# EAGLE design chipchestra-v05-buttons (EAGLE 8.0.1)
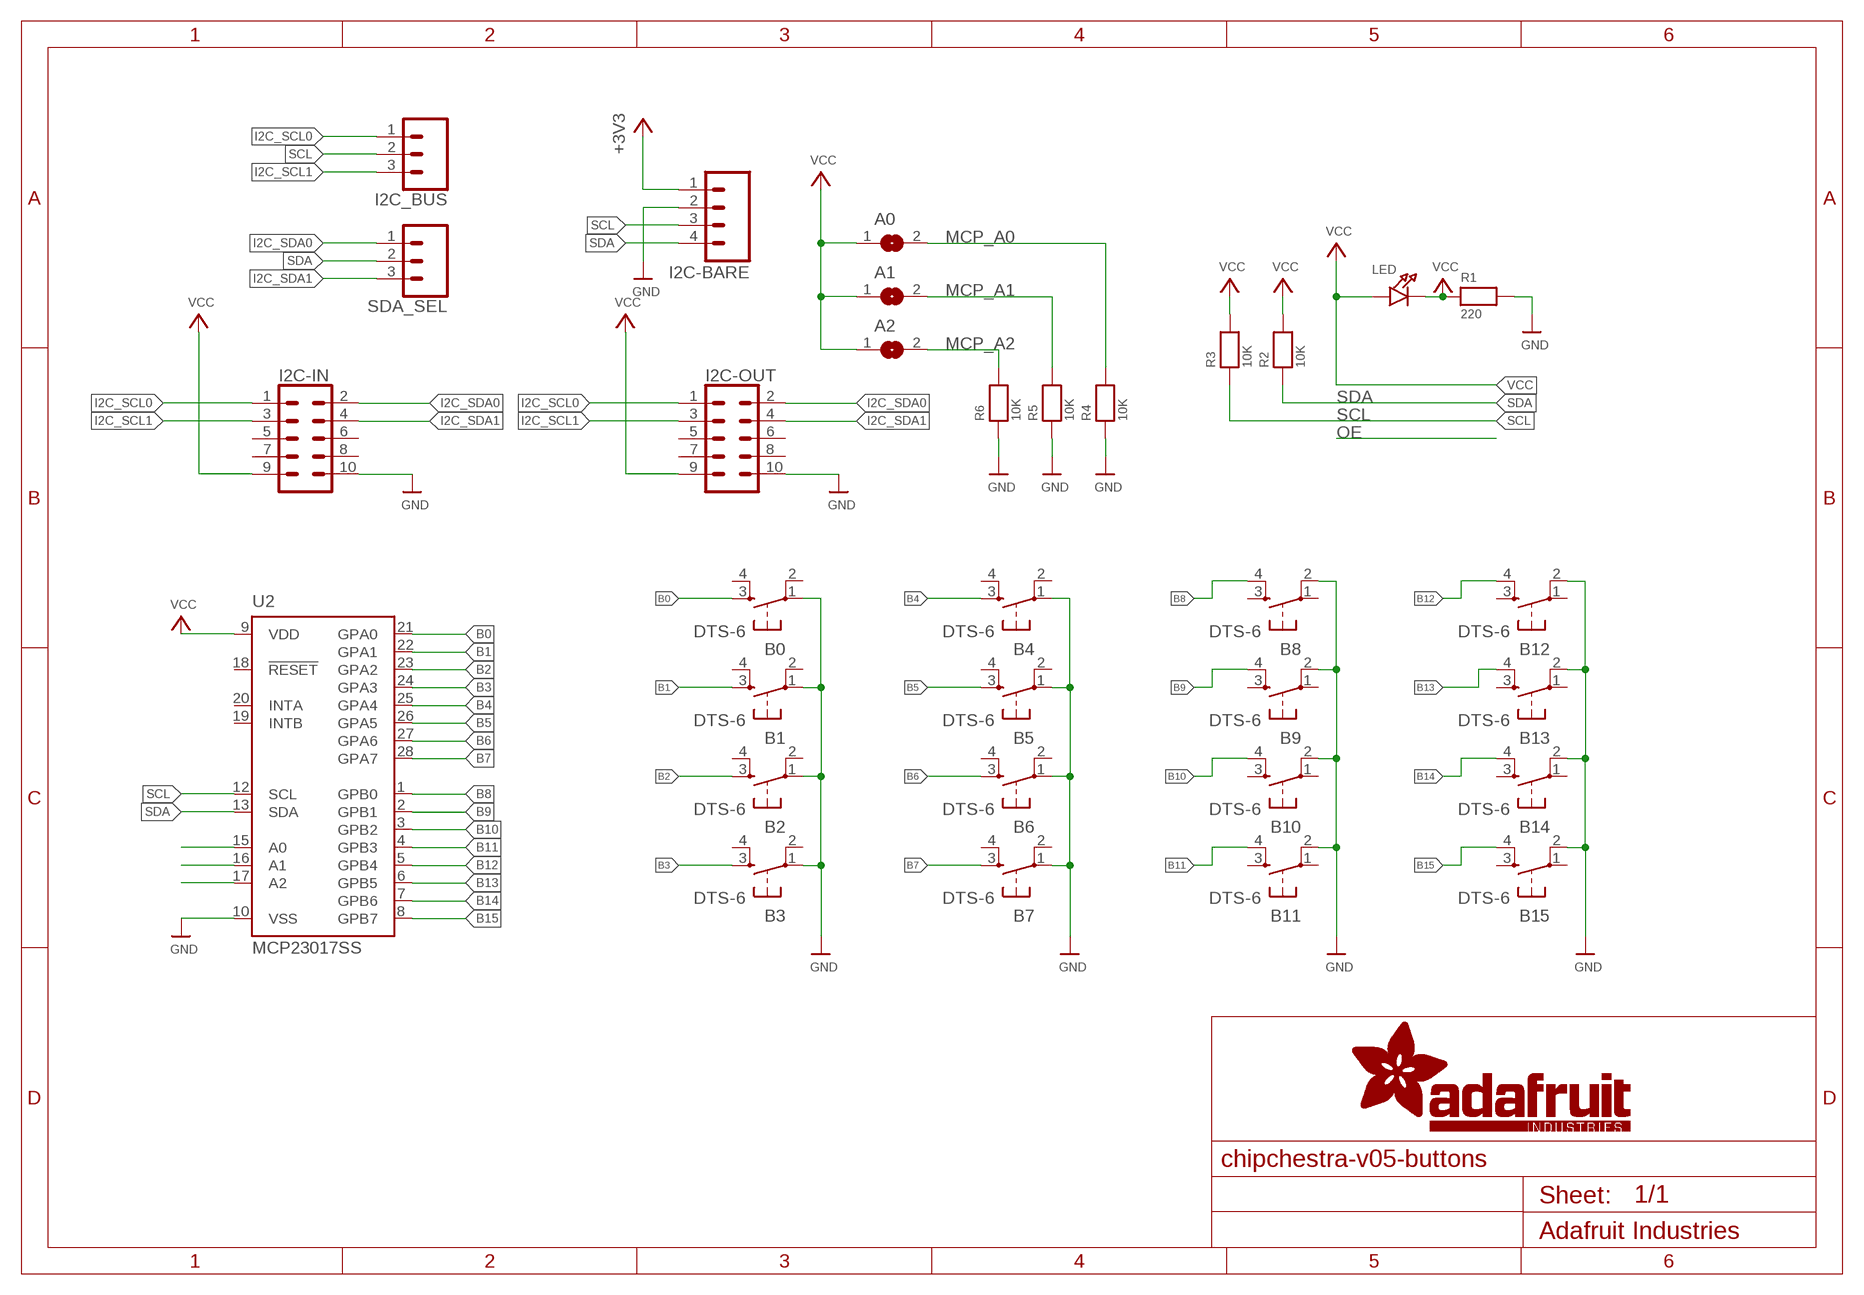
[diagram p0: schematic, sheet 1]

## Parts
A0  SOLDERJUMPERREFLOW_NOPASTE  [SOLDERJUMPER_REFLOW_NOPASTE]
A1  SOLDERJUMPERREFLOW_NOPASTE  [SOLDERJUMPER_REFLOW_NOPASTE]
A2  SOLDERJUMPERREFLOW_NOPASTE  [SOLDERJUMPER_REFLOW_NOPASTE]
B0  DTS-6  [DTS-6]
B1  DTS-6  [DTS-6]
B2  DTS-6  [DTS-6]
B3  DTS-6  [DTS-6]
B4  DTS-6  [DTS-6]
B5  DTS-6  [DTS-6]
B6  DTS-6  [DTS-6]
B7  DTS-6  [DTS-6]
B8  DTS-6  [DTS-6]
B9  DTS-6  [DTS-6]
B10  DTS-6  [DTS-6]
B11  DTS-6  [DTS-6]
B12  DTS-6  [DTS-6]
B13  DTS-6  [DTS-6]
B14  DTS-6  [DTS-6]
B15  DTS-6  [DTS-6]
I2C-BARE  M04LOCK  [1X04_LOCK]
I2C-IN  CONN_05X2SHD_LOCK  [2X5-SHROUDED_LOCK]
I2C-OUT  CONN_05X2SHD_LOCK  [2X5-SHROUDED_LOCK]
I2C_BUS  CONN_03LOCK  [1X03_LOCK]
LED  LED0805  [CHIPLED_0805]
R1  220  RESISTOR0805  [0805]
R2  10K  RESISTOR0805  [0805]
R3  10K  RESISTOR0805  [0805]
R4  10K  RESISTOR0805  [0805]
R5  10K  RESISTOR0805  [0805]
R6  10K  RESISTOR0805  [0805]
SDA_SEL  CONN_03LOCK  [1X03_LOCK]
U2  MCP23017SS  [SSOP28]

## Nets
+3V3: I2C-BARE.1
B0: B0.3 U2.21(GPA0)
B1: B1.3 U2.22(GPA1)
B2: B2.3 U2.23(GPA2)
B3: B3.3 U2.24(GPA3)
B4: B4.3 U2.25(GPA4)
B5: B5.3 U2.26(GPA5)
B6: B6.3 U2.27(GPA6)
B7: B7.3 U2.28(GPA7)
B8: B8.4 U2.1(GPB0)
B9: B9.4 U2.2(GPB1)
B10: B10.4 U2.3(GPB2)
B11: B11.4 U2.4(GPB3)
B12: B12.4 U2.5(GPB4)
B13: B13.4 U2.6(GPB5)
B14: B14.4 U2.7(GPB6)
B15: B15.4 U2.8(GPB7)
GND: B0.1 B1.1 B2.1 B3.1 B4.1 B5.1 B6.1 B7.1 B8.2 B9.2 B10.2 B11.2 B12.2 B13.2 B14.2 B15.2 I2C-BARE.2 I2C-IN.10 I2C-OUT.10 R1.2 R4.1 R5.1 R6.1 U2.10(VSS)
I2C_SCL0: I2C-IN.1 I2C-OUT.1 I2C_BUS.1
I2C_SCL1: I2C-IN.3 I2C-OUT.3 I2C_BUS.3
I2C_SDA0: I2C-IN.2 I2C-OUT.2 SDA_SEL.1
I2C_SDA1: I2C-IN.4 I2C-OUT.4 SDA_SEL.3
MCP_A0: A0.2 R4.2 U2.15(A0)
MCP_A1: A1.2 R5.2 U2.16(A1)
MCP_A2: A2.2 R6.2 U2.17(A2)
N$1: LED.C R1.1 ; supply symbol labelled VCC
SCL: I2C-BARE.3 I2C_BUS.2 R3.1 U2.12(SCL)
SDA: I2C-BARE.4 R2.1 SDA_SEL.2 U2.13(SDA)
VCC: A0.1 A1.1 A2.1 I2C-IN.9 I2C-OUT.9 LED.A R2.2 R3.2 U2.9(VDD)
Unconnected: B0.2 B0.4 B1.2 B1.4 B2.2 B2.4 B3.2 B3.4 B4.2 B4.4 B5.2 B5.4 B6.2 B6.4 B7.2 B7.4 B8.1 B8.3 B9.1 B9.3 B10.1 B10.3 B11.1 B11.3 B12.1 B12.3 B13.1 B13.3 B14.1 B14.3 B15.1 B15.3 I2C-IN.5 I2C-IN.6 I2C-IN.7 I2C-IN.8 I2C-OUT.5 I2C-OUT.6 I2C-OUT.7 I2C-OUT.8 U2.18(!RESET) U2.19(INTB) U2.20(INTA)

## Library data of the parts
A0 A1 A2 = microbuilder:SOLDERJUMPER: SMD Solder JUMPER Solder the two pads together to create a connection, or remove the solder to break it. REFLOW - Use this footprint for solder paste and reflow ovens. WAVE - Use this footprint for hand-soldering (larger pads). CLOSED - Has a trace between the two pads to ensure it is closed by default. The trace needs to be cut to disable the jumper, and can be closed again by creating a solder bridge between the two pads.
B0 B1-B15 = switch-tact:DTS-6
I2C-BARE = CMU-ArtFab:M04: Header 4 Standard 4-pin 0.1" header. Use with straight break away headers (SKU : PRT-00116), right angle break away headers (PRT-00553), swiss pins (PRT-00743), machine pins (PRT-00117), and female headers (PRT-00115). Molex polarized connector foot print use with SKU : PRT-08231 with associated crimp pins and housings. 1MM SMD Version SKU: PRT-10208
I2C-IN I2C-OUT = SparkFun-Connectors:CONN_05X2: Multi connection point. Often used as Generic Header-pin footprint for 0.1 inch spaced/style header connections For AVR SPI programming port, see special device with nice symbol: "AVR_SPI_PROG_5x2.dev" You can populate with any combo of single row headers, but if you'd like an exact match, check these: 2x5 AVR ICSP Male Header <https://www.sparkfun.com/products/778> (PRT-00778) 2x5 Pin Shrouded Header <https://www.sparkfun.com/products/8506> (PRT-08506) On any of the 0.1 inch spaced packages, you can populate with these: Break Away Headers - Straight <https://www.sparkfun.com/products/116> (PRT-00116) Break Away Male Headers - Right Angle <https://www.sparkfun.com/products/553> (PRT-00553) Female Headers <https://www.sparkfun.com/products/115> (PRT-00115) Break Away Headers - Machine Pin <https://www.sparkfun.com/products/117> (PRT-00117) Break Away Female Headers - Swiss Machine Pin <https://www.sparkfun.com/products/743> (PRT-00743) Special note: the shrouded connector mates well with our 5x2 ribbon cables: 2x5 Pin IDC Ribbon Cable <https://www.sparkfun.com/products/8535> (PRT-08535); PROD_ID: CONN-08671; SF_ID: PRT-08506
I2C_BUS SDA_SEL = SparkFun-Connectors:CONN_03: Multi connection point. Often used as Generic Header-pin footprint for 0.1 inch spaced/style header connections On any of the 0.1 inch spaced packages, you can populate with these: Break Away Headers - Straight <https://www.sparkfun.com/products/116> (PRT-00116) Break Away Male Headers - Right Angle <https://www.sparkfun.com/products/553> (PRT-00553) Female Headers <https://www.sparkfun.com/products/115> (PRT-00115) Break Away Headers - Machine Pin <https://www.sparkfun.com/products/117> (PRT-00117) Break Away Female Headers - Swiss Machine Pin <https://www.sparkfun.com/products/743> (PRT-00743) Stackable Header - 3 Pin (Female, 0.1") <https://www.sparkfun.com/products/13875> (PRT-13875) For SCREWTERMINALS and SPRING TERMINALS visit here: Screw Terimnals on SparkFun.com <https://www.sparkfun.com/search/results?term=Screw+Terminals> (5mm/3.5mm/2.54mm spacing) This device is also useful as a general connection point to wire up your design to another part of your project. Our various solder wires solder well into these plated through hole pads. Hook-Up Wire - Assortment (Stranded, 22 AWG) <https://www.sparkfun.com/products/11375> (PRT-11375) Hook-Up Wire - Assortment (Solid Core, 22 AWG) <https://www.sparkfun.com/products/11367> (PRT-11367) View the entire wire category on our website here <https://www.sparkfun.com/categories/141> Special notes: Molex polarized connector foot print use with SKU : PRT-08232 with associated crimp pins and housings.
LED = microbuilder:LED: LED 0603 - 0603 Surface Mount Package 2mA: Green LED - Low Power (3.9mcd, 2ma, 1.7Vf) - Digikey: 475-2709-2-ND Orange LED - Low Power (9.8mcd, 2ma, 1.8Vf) - Digikey: 475-1194-2-ND Red LED - Low Power (5mcd, 2ma, 1.8Vf) - Digikey: 475-1195-2-ND Yellow LED - Low Power (7mcd, 2ma, 1.8Vf) - Digikey: 475-1196-2-ND 5mA: Blue LED - Low Power (17mcd, 5ma, 2.9Vf) - Digikey: LNJ937W8CRACT-ND 0805 - 0805 Surface Mount Package 2mA: Red LED (8.8mcd, 2mA, 1.8Vf, Clear) - Low Power [Digikey: 475-2510-1-ND] Green LED (5mcd, 2mA, 1.8Vf, Clear) - Low Power [Digikey: 475-2730-1-ND] Yellow LED (11.3mcd, 2mA, 1.8Vf, Clear) - Low Power [Digikey: 475-2555-1-ND] 20mA: Red LED (104mcd, 20mA, Diffused) - LS R976 [Digikey: 475-1278-6-ND] Red LED (12mcd, 20mA, 2.0Vf, Clear) - APT2012EC [Digikey: 754-1128-1-ND] Green LED (15mcd, 20mA, 2.2Vf, Clear) - APT2012GC [Digikey: 754-1131-1-ND] Orange LED (160mcd, 20mA, 2.1Vf, Clear) - APT2012SECK [Digikey: 754-1130-1-ND] 1206 - 1206 Surface Mount Package Green LED (26mcd, 20mA, Diffused) - LG N971 [Digikey: 475-1407-6-ND] Red LED (15mcd, 20mA, Diffused) - LH N974 [Digikey: 475-1416-6-ND]
R1-R6 = microbuilder:RESISTOR: Resistors 0402 - 0402 Surface Mount Package 22 Ohm 1% 1/16W [Digikey: 311-22.0LRTR-ND] 33 Ohm 5% 1/16W 1.0K 5% 1/16W 1.5K 5% 1/16W 2.0K 1% 1/16W 10.0K 1% 1/16W [Digikey: 311-10.0KLRTR-ND] 10.0K 5% 1/16W [Digikey: RMCF0402JT10K0TR-ND] 12.1K 1% 1/16W [Digikey: 311-22.0LRTR-ND] 100.0K 5% 1/16W 0603 - 0603 Surface Mount Package 0 Ohm 1/10 Watt 1% Resistor 15 Ohm 1/10 Watt 1% Resistor 33 Ohm 1/10 Watt 1% Resistor 49.9 Ohm 1/10 Watt 1% Resistor 100 Ohm 1/10 Watt 1% Resistor 150 Ohm 1/10 Watt 1% Resistor 240 Ohm 1/10 Watt 1% Resistor 390 Ohm 1/10 Watt 1% Resistor 560 Ohm 1/10 Watt 1% Resistor 680 Ohm 1/10 Watt 1% Resistor 750 Ohm 1/10 Watt 1% Resistor 1.0K Ohm 1/10 Watt 1% Resistor 1.5K Ohm 1/10 Watt 1% Resistor 2.0K Ohm 1/10 Watt 1% Resistor 2.2K Ohm 1/10 Watt 1% Resistor 3.3K Ohm 1/10 Watt 1% Resistor 4.7K Ohm 1/10 Watt 1% Resistor 10.0K Ohm 1/10 Watt 1% Resistor 12.0K Ohm 1/10 Watt 1% Resistor 12.1K Ohm 1/10 Watt 1% Resistor 20.0K Ohm 1/10 Watt 1% Resistor 33.0K Ohm 1/10 Watt 1% Resistor 100.0K Ohm 1/10 Watt 1% Resistor 0805 - 0805 Surface Mount Package 0 Ohm 1/8 Watt 1% Resistor 33 Ohm 1/8 Watt 1% Resistor 100 Ohm 1/8 Watt 1% Resistor 150 Ohm 1/8 Watt 1% Resistor 200 Ohm 1/8 Watt 1% Resistor 240 Ohm 1/8 Watt 1% Resistor 330 Ohm 1/8 Watt 1% Resistor 390 Ohm 1/8 Watt 1% Resistor 470 Ohm 1/8 Watt 1% Resistor 1.0K Ohm 1/8 Watt 1% Resistor 1.5K Ohm 1/8 Watt 1% Resistor 2.0K Ohm 1/8 Watt 1% Resistor 4.7K Ohm 1/8 Watt 1% Resistor 5.1K Ohm 1/8 Watt 1% Resistor 5.6K Ohm 1/8 Watt 1% Resistor 10.0K Ohm 1/8 Watt 1% Resistor 22.0K Ohm 1/8 Watt 1% Resistor 33.0K Ohm 1/8 Watt 1% Resistor 100K Ohm 1/8 Watt 1% Resistor 1206 - 1206 Surface Mount Package 2012 - 2010 Surface Mount Package 0.11 Ohm 1/2 Watt 1% Resistor - Digikey: RHM.11UCT-ND
U2 = microchip:MCP23017: http://ww1.microchip.com/downloads/en/DeviceDoc/21952a.pdf Source: http://ww1.microchip.com/downloads/en/DeviceDoc/21952a.pdf; MF: MICROCHIP; MPN: MCP23017-E/SS; OC_FARNELL: 1467674; OC_NEWARK: 31K2960

## Net classes
0 default: width 0.203 mm, clearance 0.152 mm

## Board
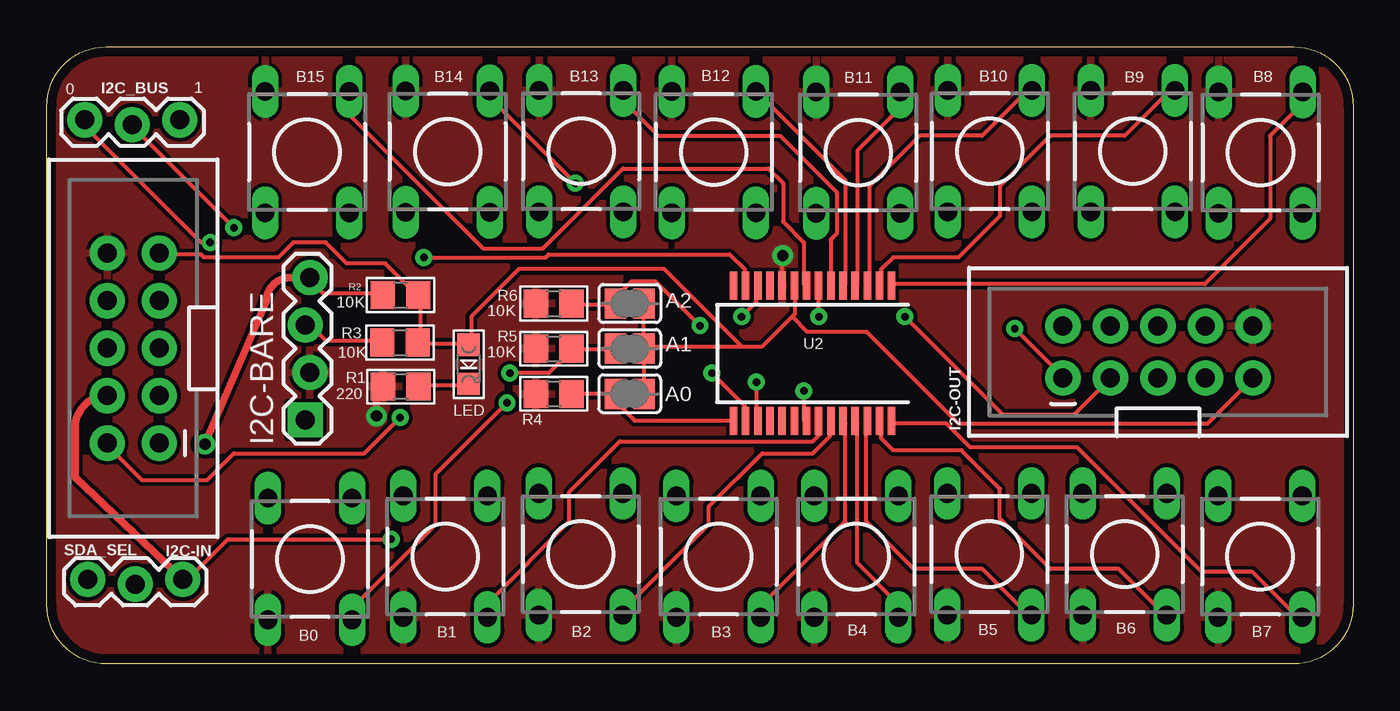
[diagram p1: board, top side]
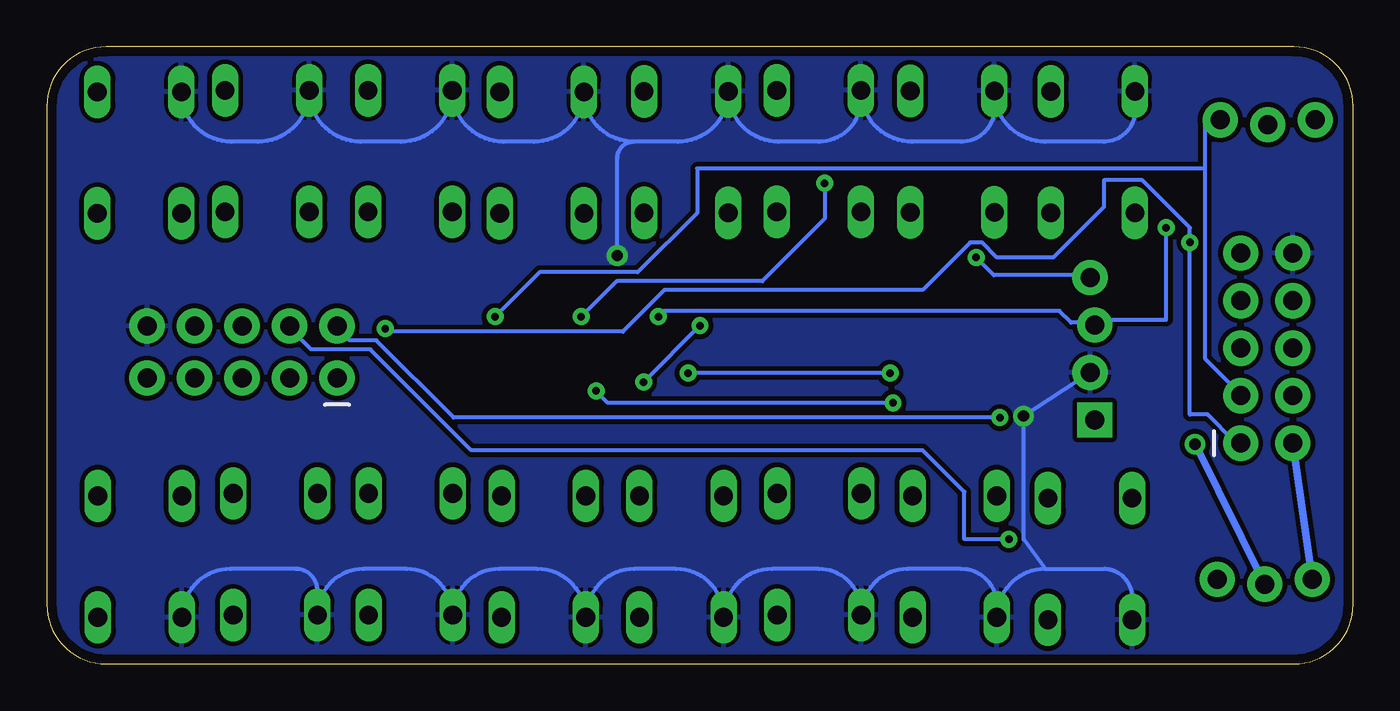
[diagram p2: board, bottom side, seen from below]

Size 69.85 x 33.02 mm. Coordinates in mm from the lower left corner, seen from the top.
Outline: 3.17,0 arc-90 0,3.17 0,29.84 arc-90 3.17,33.02 66.67,33.02 arc-90 69.85,29.84 69.85,3.17 arc-90 66.67,0 3.17,0
Copper layers (1*16): Top 0.035mm / dielectric 1.5mm / Bottom 0.035mm
Design rules "PCBCart-Standard *": minimum track width 8mil, minimum drill 0.4mm, track to track 8mil, track to pad 8mil, pad to pad 8mil, via to via 8mil, smd to smd 8mil, copper to edge 20mil, drill to drill 8mil, minimum pad ring 8mil, minimum via ring 10mil, stop-mask expansion 3mil, vias tented up to drill 20mil, thermal gap 8mil

### Footprints (pad centres in the part's own frame; a part is rotated, then mirrored left to right if it is on the bottom)
SOLDERJUMPER_REFLOW_NOPASTE = smd 1.168 x 1.6: 1 -0.762,0; 2 0.762,0
DTS-6 = drill 1 long: 1 -3.25,2.25; 2 3.25,2.25; 3 -3.25,-2.25; 4 3.25,-2.25
1X04_LOCK = drill 1.016 pad 1.88 square: 1 0,0.127 | drill 1.016 pad 1.88: 2 2.54,-0.127; 3 5.08,0.127; 4 7.62,-0.127
2X5-SHROUDED_LOCK = drill 1.016 pad 1.88: 1 -1.397,5.08; 2 1.397,5.08; 3 -1.397,2.54; 4 1.397,2.54; 5 -1.397,0; 6 1.397,0; 7 -1.397,-2.54; 8 1.397,-2.54; 9 -1.397,-5.08; 10 1.397,-5.08
1X03_LOCK = drill 1.016 pad 1.88: 1 0,0.127; 2 2.54,-0.127; 3 5.08,0.127
CHIPLED_0805 = smd 1.2 x 1.2: A 0,-1.05; C 0,1.05
0805 = smd 1.3 x 1.5: 1 -0.95,0; 2 0.95,0
SSOP28 = smd 0.4 x 1.5: 1 -4.225,-3.625; 2 -3.575,-3.625; 3 -2.925,-3.625; 4 -2.275,-3.625; 5 -1.625,-3.625; 6 -0.975,-3.625; 7 -0.325,-3.625; 8 0.325,-3.625; 9 0.975,-3.625; 10 1.625,-3.625; 11 2.275,-3.625; 12 2.925,-3.625; 13 3.575,-3.625; 14 4.225,-3.625; 15 4.225,3.625; 16 3.575,3.625; 17 2.925,3.625; 18 2.275,3.625; 19 1.625,3.625; 20 0.975,3.625; 21 0.325,3.625; 22 -0.325,3.625; 23 -0.975,3.625; 24 -1.625,3.625; 25 -2.275,3.625; 26 -2.925,3.625; 27 -3.575,3.625; 28 -4.225,3.625

### Placement (x,y rotation side)
A0  31.17,14.45 180 top
A1  31.17,16.87 180 top
A2  31.17,19.28 180 top
B0  14.07,5.61 90 top
B1  21.31,5.74 90 top
B2  28.55,5.87 90 top
B3  35.92,5.74 90 top
B4  43.28,5.74 90 top
B5  50.39,5.87 90 top
B6  57.63,5.87 90 top
B7  64.87,5.74 90 top
B8  64.9,27.36 90 top
B9  58.06,27.43 90 top
B10  50.42,27.43 90 top
B11  43.38,27.36 90 top
B12  35.66,27.38 90 top
B13  28.57,27.43 90 top
B14  21.44,27.41 90 top
B15  13.92,27.38 90 top
I2C-BARE  13.94,13.06 90 top
I2C-IN  4.62,16.89 180 top
I2C-OUT  59.41,16.69 90 top
I2C_BUS  2.03,28.98 0 top
LED  22.56,16.03 180 top
R1  18.92,14.83 180 top
R2  18.91,19.73 0 top
R3  18.88,17.19 0 top
R4  27.1,14.45 0 top
R5  27.1,16.87 0 top
R6  27.1,19.28 0 top
SDA_SEL  2.18,4.39 0 top
U2  40.94,16.61 180 top

### Tracks (layer width: path | path; a pad name or v marks a point on that pad's centre or on a via)
B0  (via drill 0.4)
  Top 0.203: v40.48,14.61 40.48,13.02 U2.21 | v24.61,13.97 20.8,10.16 20.8,7.46 16.35,3.02 16.35,2.38 B0.3
  Bottom 0.203: v40.48,14.61 39.85,13.97 v24.61,13.97
B1
  Top 0.203: U2.22 41.27,12.86 41.27,12.22 40.96,11.91 30.64,11.91 27.94,9.21 27.94,7.62 23.65,3.33 23.65,2.54 B1.3
B2
  Top 0.203: U2.23 41.91,12.86 41.91,12.22 40.96,11.27 38.26,11.27 35.4,8.41 35.4,7.46 30.96,3.02 30.96,2.7 B2.3
B3
  Top 0.203: U2.24 42.7,12.86 42.7,7.62 38.26,3.17 38.26,2.54 B3.3
B4
  Top 0.203: U2.25 43.34,12.86 43.34,5.4 45.4,3.33 45.4,2.54 B4.3
B5
  Top 0.203: U2.26 43.81,12.86 43.81,7.62 46.35,5.08 50.01,5.08 52.55,2.54 B5.3
B6
  Top 0.203: U2.27 44.61,12.86 44.61,12.06 45.24,11.43 48.89,11.43 50.96,9.37 50.96,7.78 53.66,5.08 57.31,5.08 59.85,2.54 B6.3
B7
  Top 0.203: U2.28 45.24,12.86 48.1,12.86 49.37,11.59 55.09,11.59 61.75,4.92 64.45,4.92 66.99,2.38 B7.3
B8
  Top 0.203: U2.1 45.24,20.32 61.91,20.32 65.41,23.81 65.41,28.26 66.99,29.84 66.99,30.48 B8.4
B9
  Top 0.203: U2.2 44.61,20.32 44.61,21.11 45.24,21.75 48.74,21.75 50.96,23.97 50.96,25.56 53.66,28.26 57.63,28.26 60.17,30.8 B9.4
B10
  Top 0.203: U2.3 43.97,20.32 43.97,25.56 46.67,28.26 50.01,28.26 52.55,30.8 B10.4
B11
  Top 0.203: U2.4 43.34,20.32 43.34,27.46 45.56,29.69 45.56,30.48 B11.4
B12
  Top 0.203: U2.5 42.7,20.32 42.7,25.88 37.94,30.64 B12.4
B13
  Top 0.203: U2.6 41.91,20.32 41.91,22.7 42.23,23.02 42.23,25.24 39.21,28.26 32.7,28.26 30.96,30 30.96,30.64 B13.4
B14  (via drill 0.4)
  Top 0.203: v41.27,18.57 41.27,20.16 U2.7 | v28.26,25.72 23.81,30.16 23.81,30.64 B14.4
  Bottom 0.203: v41.27,18.57 39.37,20.48 31.59,20.48 28.26,23.81 v28.26,25.72
B15
  Top 0.203: U2.8 40.48,20.32 40.48,22.54 39.37,23.65 39.37,25.72 38.58,26.51 30.8,26.51 26.51,22.23 23.34,22.23 16.19,29.37 16.19,30.48 B15.4
GND  (via drill 0.6)
  Top 0.203: U2.10 39.32,21.82 arc-90 v39.34,21.84
  Top 0.406: R1.2 17.63,14.83 v17.63,13.26
  Bottom 0.203: B15.2 11.67,29.61 arc90 13.33,27.94 16.47,27.94 arc90 B14.2 19.19,29.71 arc90 20.95,27.94 23.58,27.94 arc90 B13.2 26.32,30.19 arc90 28.57,27.94 30.72,27.94 arc90 B12.2 arc90 36.1,27.94 38.47,27.94 | 38.47,27.94 arc90 B11.2 arc90 43.8,27.94 45.43,27.94 arc90 B10.2 arc90 50.91,27.94 53.07,27.94 arc90 B9.2 arc90 58.56,27.94 59.98,27.94 arc90 B8.2 | v39.34,21.84 39.34,27.06 arc90 38.47,27.94 | B0.1 11.82,3.57 arc-90 13.33,5.08 16.47,5.08 | 16.47,5.08 arc-90 B1.1 19.06,3.19 arc-90 20.95,5.08 23.84,5.08 arc-90 B2.1 26.3,2.81 arc-90 28.57,5.08 31.08,5.08 arc-90 B3.1 33.67,2.55 arc-90 36.2,5.08 38.44,5.08 arc-90 B4.1 arc-90 43.62,5.08 45.68,5.08 arc-90 B5.1 arc-90 50.61,5.08 52.92,5.08 arc-90 B6.1 55.38,3.95 arc-90 56.52,5.08 60.03,5.08 arc-90 B7.1 | 16.47,5.08 17.63,6.66 v17.63,13.26 I2C-BARE.2
  pour Bottom (isolate 0.254): -0.81,-1.07 -0.66,33.68 70.4,33.56 70.4,-0.99
  pour Top: 71.75,35.56 -1.91,35.56 -1.91,-2.54 71.75,-2.54
I2C_SCL0  (via drill 0.4)
  Top 0.203: v8.73,22.54 8.25,22.54 2.06,28.73 2.06,29.05 I2C_BUS.1 | v51.75,17.94 54.29,15.4 I2C-OUT.1
  Bottom 0.203: I2C-IN.1 6.03,11.91 6.35,11.91 7.78,13.34 8.73,13.34 v8.73,22.54 8.73,23.34 11.27,25.88 13.33,25.88 13.33,24.45 16.03,21.75 19.05,21.75 19.84,22.54 20.48,22.54 23.02,20 36.83,20 39.05,17.78 51.59,17.78 v51.75,17.94
I2C_SCL1  (via drill 0.4)
  Top 0.203: v45.88,18.57 51.12,13.34 54.93,13.34 56.83,15.24 I2C-OUT.3
  Bottom 0.203: 7.94,26.51 7.94,29.05 7.14,29.05 I2C_BUS.3 | 7.94,26.51 7.94,16.35 6.03,14.45 I2C-IN.3 | v45.88,18.57 43.5,20.95 38.26,20.95 35.08,24.13 35.08,26.51 7.94,26.51
I2C_SDA0  (via drill 0.4)
  Top 0.203: v18.89,13.18 16.99,11.27 10,11.27 8.57,9.84 5.08,9.84 3.17,11.75 I2C-IN.2
  Bottom 0.203: v18.89,13.18 48.1,13.18 52.23,17.3 53.66,17.3 54.29,17.94 I2C-OUT.2
  Bottom 0.406: I2C-IN.2 SDA_SEL.1
I2C_SDA1  (via drill 0.4)
  Top 0.203: v18.41,6.67 9.68,6.67 7.46,4.45 SDA_SEL.3
  Top 0.406: SDA_SEL.3 1.52,9.98 1.52,12.65 arc-90 I2C-IN.4
  Bottom 0.203: v18.41,6.67 20.8,6.67 20.8,9.21 23.02,11.43 47.15,11.43 52.55,16.83 55.72,16.83 56.83,17.94 I2C-OUT.4
MCP_A0
  Top 0.203: 30,14.45 30.32,14.45 A0.2 30,14.45 | 30,14.45 28.1,14.45 R4.2 | 30,14.45 31.43,13.02 36.67,13.02 U2.15
MCP_A1  (via drill 0.4)
  Top 0.203: 28.1,16.83 30.32,16.83 A1.2 | v35.56,15.56 37.31,13.81 37.31,13.02 U2.16 | v24.77,15.56 26.83,15.56 28.1,16.83 | 28.1,16.83 R5.2
  Bottom 0.203: v24.77,15.56 v35.56,15.56
MCP_A2  (via drill 0.4)
  Top 0.203: 30,19.21 30.32,19.21 A2.2 30,19.21 | 30,19.21 28.1,19.21 R6.2 | v37.94,15.08 37.94,13.02 U2.17 | v34.92,18.1 32.54,20.48 31.27,20.48 30,19.21
  Bottom 0.203: v34.92,18.1 v37.94,15.08
N$1
  Top 0.203: LED.C 22.54,14.92 20,14.92 R1.1
SCL  (via drill 0.4)
  Top 0.203: R3.1 17.78,17.3 14.92,17.3 13.97,18.26 I2C-BARE.3 | v37.15,18.57 37.94,19.37 37.94,20.16 U2.12 | v10,23.34 4.6,28.73 I2C_BUS.2
  Bottom 0.203: v37.15,18.57 36.83,18.89 15.72,18.89 15.08,18.26 13.97,18.26 I2C-BARE.3 13.81,18.26 13.02,18.26 12.86,18.41 10,18.41 v10,23.34
SDA  (via drill 0.4, 0.6)
  Top 0.203: R2.1 17.94,19.84 14.76,19.84 14.13,20.48 I2C-BARE.4 | v20.16,21.75 26.67,21.75 26.83,21.91 36.51,21.91 37.31,21.11 37.31,20.32 U2.13
  Top 0.406: v8.46,11.76 11.73,19.38 arc-90 13.03,20.68 I2C-BARE.4
  Bottom 0.203: v20.16,21.75 19.21,20.8 14.13,20.8 I2C-BARE.4
  Bottom 0.406: SDA_SEL.2 v8.46,11.76
VCC
  Top 0.203: 20,17.14 19.84,17.14 R3.2 20,17.14 | 20,17.14 22.54,17.14 LED.A 22.7,17.14 22.7,18.57 25.24,21.11 33.02,21.11 37.15,16.99 | 20,17.14 20,19.68 R2.2 19.84,19.68 18.1,21.43 16.03,21.43 14.92,22.54 13.18,22.54 12.38,21.75 8.41,21.75 8.25,21.91 6.03,21.91 I2C-IN.9 | 39.85,18.57 38.26,16.99 37.15,16.99 | 39.85,18.57 40,18.73 40,20.16 U2.9 | 37.15,16.99 32.07,16.99 A1.1 | A0.1 31.91,14.61 31.91,16.83 A1.1 | A2.1 31.91,19.21 31.91,16.99 A1.1 | 39.85,18.57 40.64,17.78 43.81,17.78 48.74,12.86 62.07,12.86 64.45,15.24 I2C-OUT.9